# EAGLE design Final (EAGLE 9.4.2)
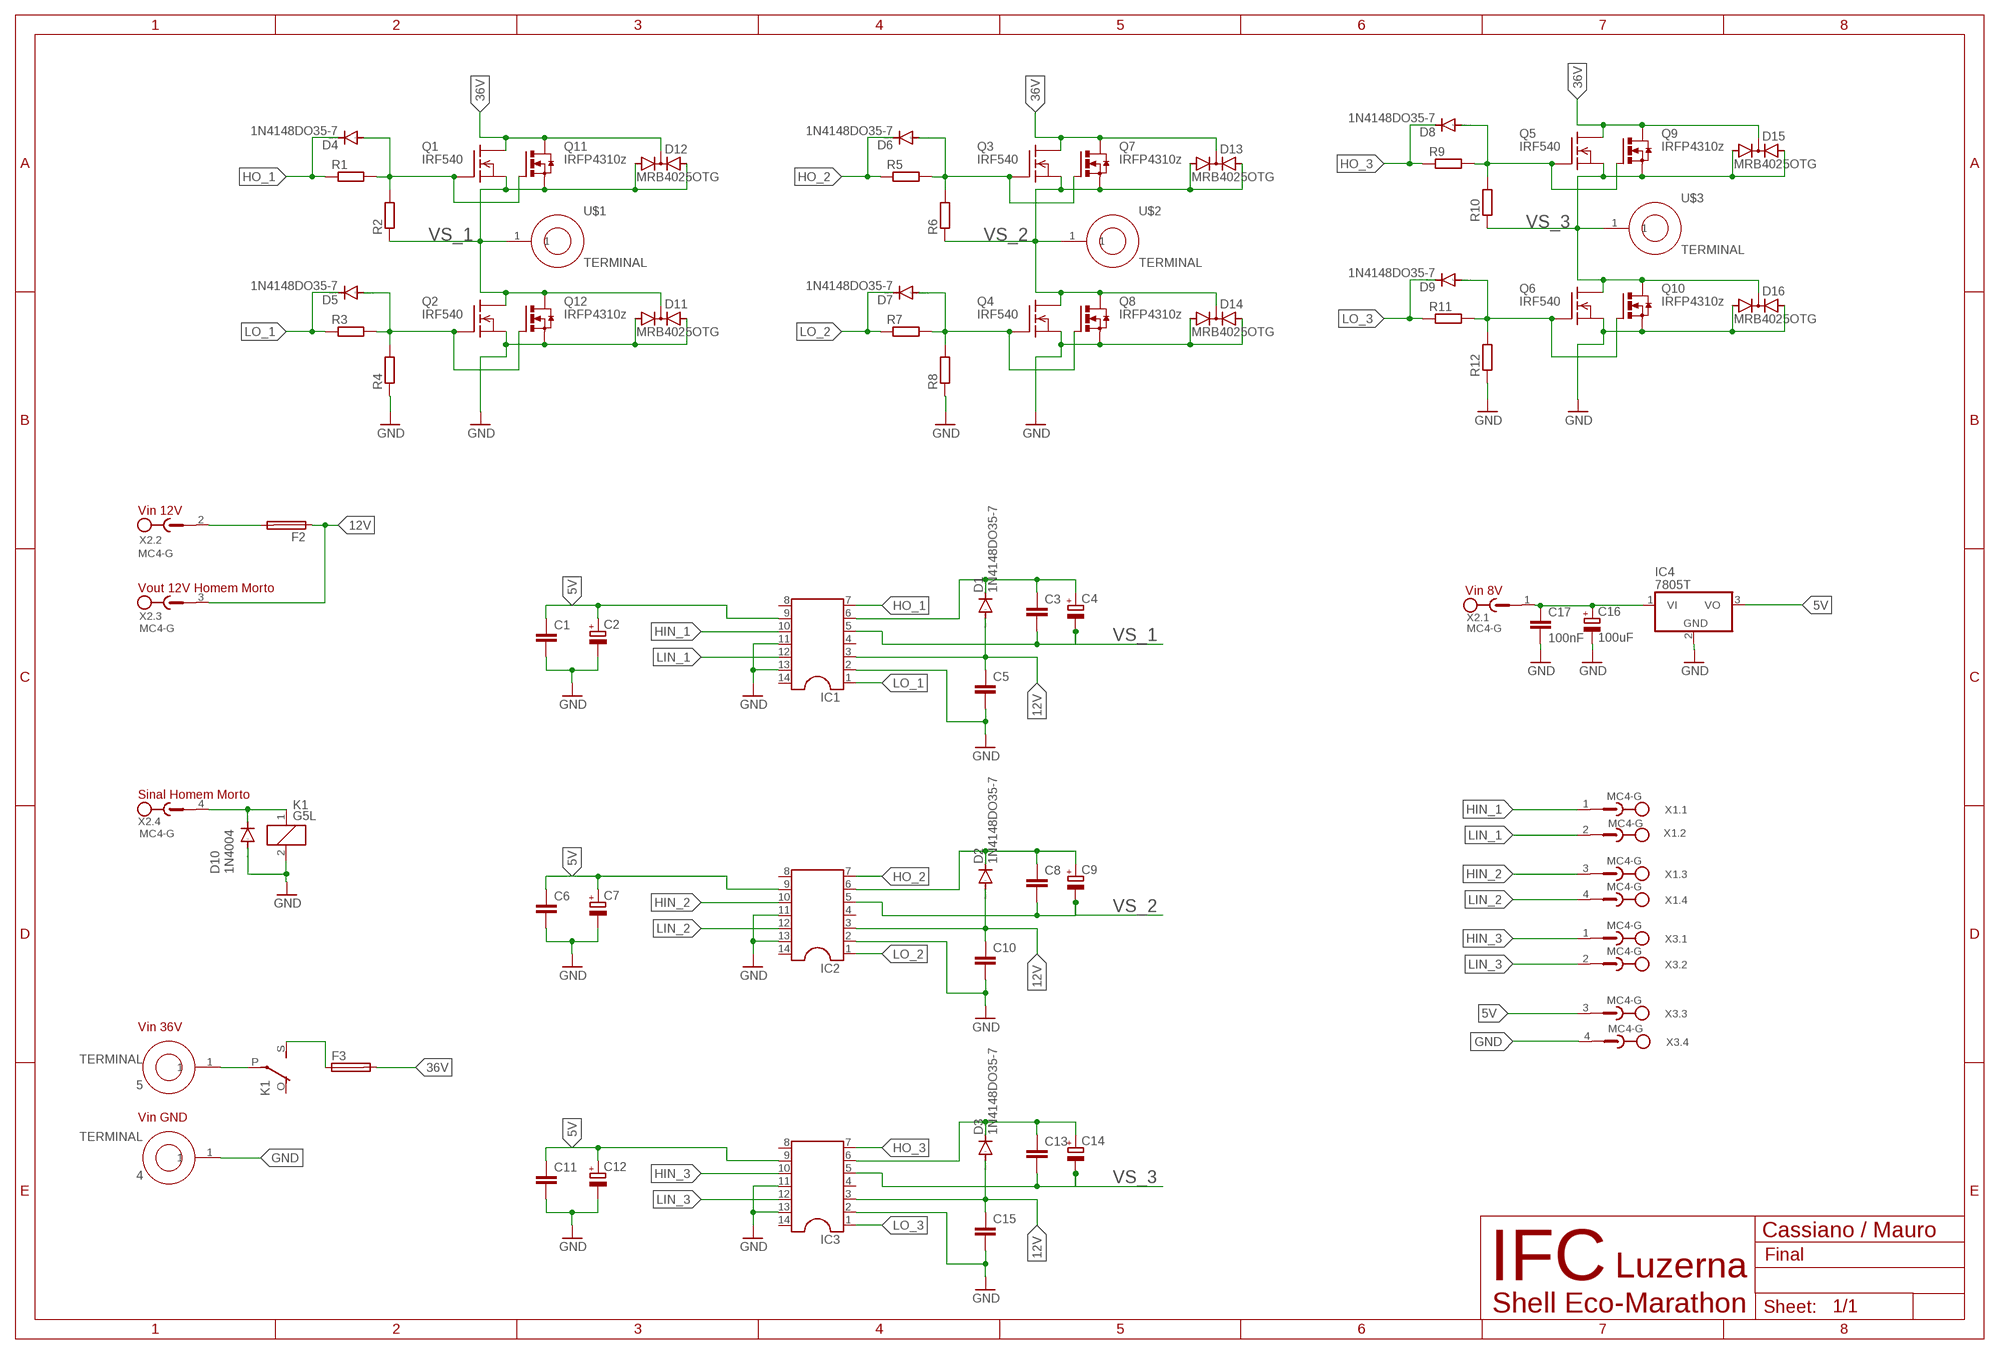
[diagram p0: schematic, sheet 1]

## Parts
4  TERMINAL  [TERMINAL]
5  TERMINAL  [TERMINAL]
C1  C-EU050-045X075  [C050-045X075]
C2  CPOL-EUE2.5-7  [E2,5-7]
C3  C-EU050-025X075  [C050-025X075]
C4  CPOL-EUE2.5-7  [E2,5-7]
C5  C-EU050-025X075  [C050-025X075]
C6  C-EU050-045X075  [C050-045X075]
C7  CPOL-EUE2.5-7  [E2,5-7]
C8  C-EU050-025X075  [C050-025X075]
C9  CPOL-EUE2.5-7  [E2,5-7]
C10  C-EU050-025X075  [C050-025X075]
C11  C-EU050-045X075  [C050-045X075]
C12  CPOL-EUE2.5-7  [E2,5-7]
C13  C-EU050-025X075  [C050-025X075]
C14  CPOL-EUE2.5-7  [E2,5-7]
C15  C-EU050-025X075  [C050-025X075]
C16  100uF  CPOL-EUE2.5-7  [E2,5-7]
C17  100nF  C-EU050-045X075  [C050-045X075]
D1  1N4148DO35-7  [DO35-7]
D2  1N4148DO35-7  [DO35-7]
D3  1N4148DO35-7  [DO35-7]
D4  1N4148DO35-7  [DO35-7]
D5  1N4148DO35-7  [DO35-7]
D6  1N4148DO35-7  [DO35-7]
D7  1N4148DO35-7  [DO35-7]
D8  1N4148DO35-7  [DO35-7]
D9  1N4148DO35-7  [DO35-7]
D10  1N4004  [DO41-10]
D11  MRB4025OTG  MUR620CT  [TO220AB]
D12  MRB4025OTG  MUR620CT  [TO220AB]
D13  MRB4025OTG  MUR620CT  [TO220AB]
D14  MRB4025OTG  MUR620CT  [TO220AB]
D15  MRB4025OTG  MUR620CT  [TO220AB]
D16  MRB4025OTG  MUR620CT  [TO220AB]
F2  SH22,5A  [SH22,5A]
F3  SH22,5A  [SH22,5A]
IC1  DIL14  [DIL14]
IC2  DIL14  [DIL14]
IC3  DIL14  [DIL14]
IC4  7805T  [TO220H]
K1  G5L  [G5LE]
Q1  IRF540  [TO220]
Q2  IRF540  [TO220]
Q3  IRF540  [TO220]
Q4  IRF540  [TO220]
Q5  IRF540  [TO220]
Q6  IRF540  [TO220]
Q7  IRFP4310z  IRFP240-H  [TO247BH]
Q8  IRFP4310z  IRFP240-H  [TO247BH]
Q9  IRFP4310z  IRFP240-H  [TO247BH]
Q10  IRFP4310z  IRFP240-H  [TO247BH]
Q11  IRFP4310z  IRFP240-H  [TO247BH]
Q12  IRFP4310z  IRFP240-H  [TO247BH]
R1  R-EU_0204/7  [0204/7]
R2  R-EU_0204/7  [0204/7]
R3  R-EU_0204/7  [0204/7]
R4  R-EU_0204/7  [0204/7]
R5  R-EU_0204/7  [0204/7]
R6  R-EU_0204/7  [0204/7]
R7  R-EU_0204/7  [0204/7]
R8  R-EU_0204/7  [0204/7]
R9  R-EU_0204/7  [0204/7]
R10  R-EU_0204/7  [0204/7]
R11  R-EU_0204/7  [0204/7]
R12  R-EU_0204/7  [0204/7]
U$1  TERMINAL  [TERMINAL]
U$2  TERMINAL  [TERMINAL]
U$3  TERMINAL  [TERMINAL]
X1  MC4-G  [MC4-G]
X2  MC4-G  [MC4-G]
X3  MC4-G  [MC4-G]

## Nets
5V: C1.1 C2.+ C6.1 C7.+ C11.1 C12.+ IC1.9 IC2.9 IC3.9 IC4.3(VO) X3.3
12V: C5.1 C10.1 C15.1 D1.A D2.A D3.A F2.1 IC1.3 IC2.3 IC3.3 X2.3
36V: D12.C D13.C D15.C F3.2 Q1.2(D) Q3.2(D) Q5.2(D) Q7.D Q9.D Q11.D
GND: 4.1 C1.2 C2.- C5.2 C6.2 C7.- C10.2 C11.2 C12.- C15.2 C16.- C17.2 D10.A D11.A1 D11.A2 D14.A1 D14.A2 D16.A1 D16.A2 IC1.2 IC1.11 IC1.13 IC2.2 IC2.11 IC2.13 IC3.2 IC3.11 IC3.13 IC4.2(GND) K1.2 Q2.3(S) Q4.3(S) Q6.3(S) Q8.S Q10.S Q12.S R4.1 R8.1 R12.1 X3.4
HIN_1: IC1.10 X1.1
HIN_2: IC2.10 X1.3
HIN_3: IC3.10 X3.1
HO_1: D4.C IC1.7 R1.1
HO_2: D6.C IC2.7 R5.1
HO_3: D8.C IC3.7 R9.1
LIN_1: IC1.12 X1.2
LIN_2: IC2.12 X1.4
LIN_3: IC3.12 X3.2
LO_1: D5.C IC1.1 R3.1
LO_2: D7.C IC2.1 R7.1
LO_3: D9.C IC3.1 R11.1
N$1: D4.A Q1.1(G) Q11.G R1.2 R2.2
N$2: D5.A Q2.1(G) Q12.G R3.2 R4.2
N$3: F3.1 K1.S(2:S)
N$4: D6.A Q3.1(G) Q7.G R5.2 R6.2
N$5: D7.A Q4.1(G) Q8.G R7.2 R8.2
N$6: F2.2 X2.2
N$7: D8.A Q5.1(G) Q9.G R9.2 R10.2
N$8: D9.A Q6.1(G) Q10.G R11.2 R12.2
N$9: C16.+ C17.1 IC4.1(VI) X2.1
N$10: D10.C K1.1 X2.4
N$11: 5.1 K1.P(2:P)
VB_1: C3.1 C4.+ D1.C IC1.6
VB_2: C8.1 C9.+ D2.C IC2.6
VB_3: C13.1 C14.+ D3.C IC3.6
VS_1: C3.2 C4.- D11.C D12.A1 D12.A2 IC1.5 Q1.3(S) Q2.2(D) Q11.S Q12.D R2.1 U$1.1
VS_2: C8.2 C9.- D13.A1 D13.A2 D14.C IC2.5 Q3.3(S) Q4.2(D) Q7.S Q8.D R6.1 U$2.1
VS_3: C13.2 C14.- D15.A1 D15.A2 D16.C IC3.5 Q5.3(S) Q6.2(D) Q9.S Q10.D R10.1 U$3.1
Unconnected: IC1.4 IC1.8 IC1.14 IC2.4 IC2.8 IC2.14 IC3.4 IC3.8 IC3.14 K1.O(2:O)

## Notes on the sheet
- Vin 12V
- Vout 12V Homem Morto
- Vin 8V
- Sinal Homem Morto
- Vin 36V
- Vin GND
- Cassiano / Mauro
- IFC | Luzerna
- Shell Eco-Marathon

## Library data of the parts
4 5 U$1-U$3 = ,Kerschbaumer:TERMINAL
C1 C3 C5 C6 C8 C10 C11 C13 C15 C17 = rcl:C-EU: CAPACITOR, European symbol
C2 C4 C7 C9 C12 C14 C16 = rcl:CPOL-EU: POLARIZED CAPACITOR, European symbol
D1-D9 = diode:1N4148: DIODE high speed (Philips)
D10 = diode:1N4004: DIODE general purpose rectifier, 1 A
D11-D16 = diode:MUR620CT: DIODE dual rectifier, 6 A, 200 V, common cathode
F2 F3 = fuse:SH22,5A: FUSE HOLDER grid 22,5mm, isolated cap OGN0031 8201, Schurter (Buerklin); MPN: 0031.7701.11; OC_FARNELL: unknown; OC_NEWARK: 04F1224
IC1-IC3 = ic-package:DIL14: Dual In Line / Socket
IC4 = ,RK_outros:78*: Positive VOLTAGE REGULATOR
K1 = relay:G5L: RELAY 1 x switch, 10 A/120 V AC, 8 A/30 V ADC, Omron; OC_FARNELL: unknown; OC_NEWARK: unknown
Q1-Q6 = transistor-fet:IRF540: N-Channel Enhancement MOSFET (HEXFET); 100V; 28A; 0,077Ohm
Q7-Q12 = transistor-power:IRFP240: HEXFET Power MosFet Source: http://www.irf.com/
R1-R12 = rcl:R-EU_: RESISTOR, European symbol
X1-X3 = con-phoenix-381_l:MC4-G: Mini-Combicon 3.81mm horizontal 4-polig MC 1,5/4-G-3,81 Artikel-Nr. 1803293 mit Gegenstecker MC 1,5/4-ST-3,81 Artikel-Nr. 1803594

## Board
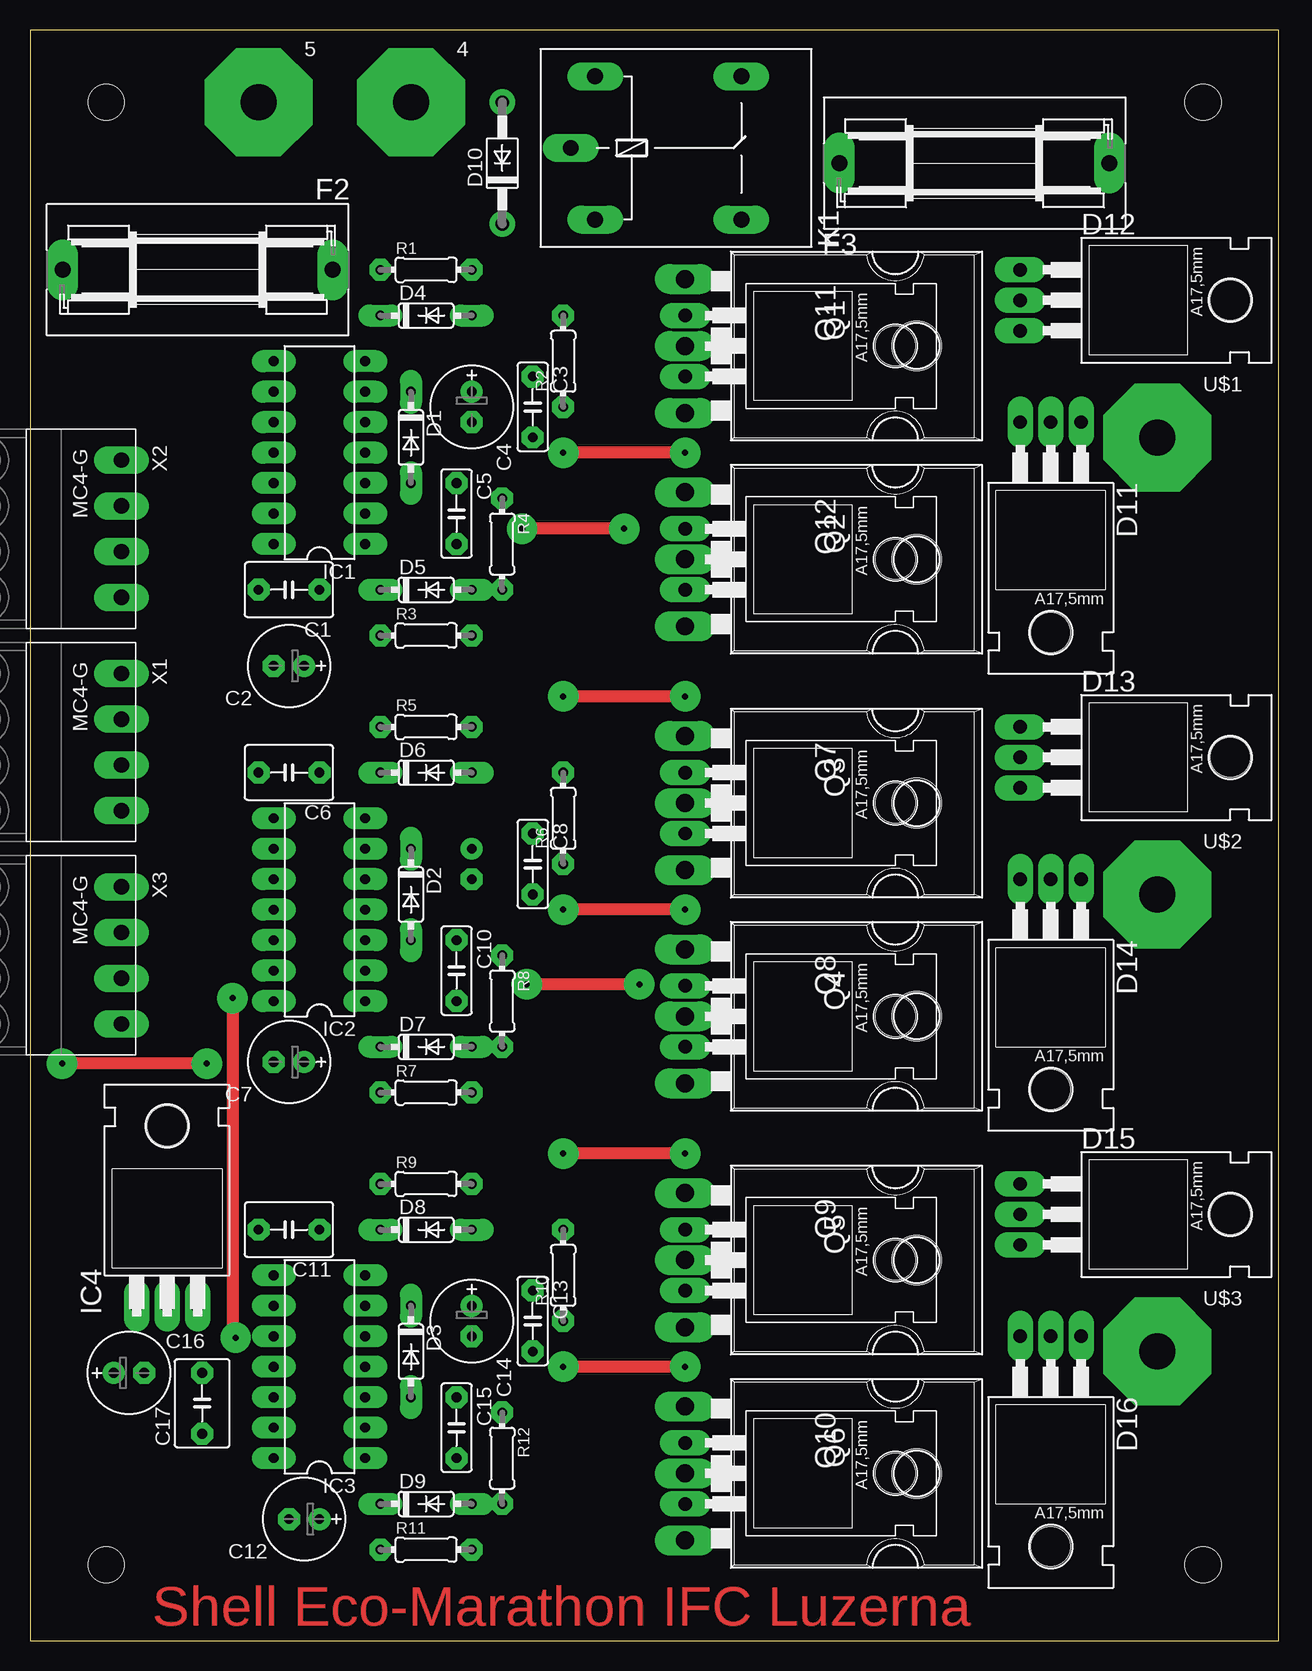
[diagram p1: board, top side]
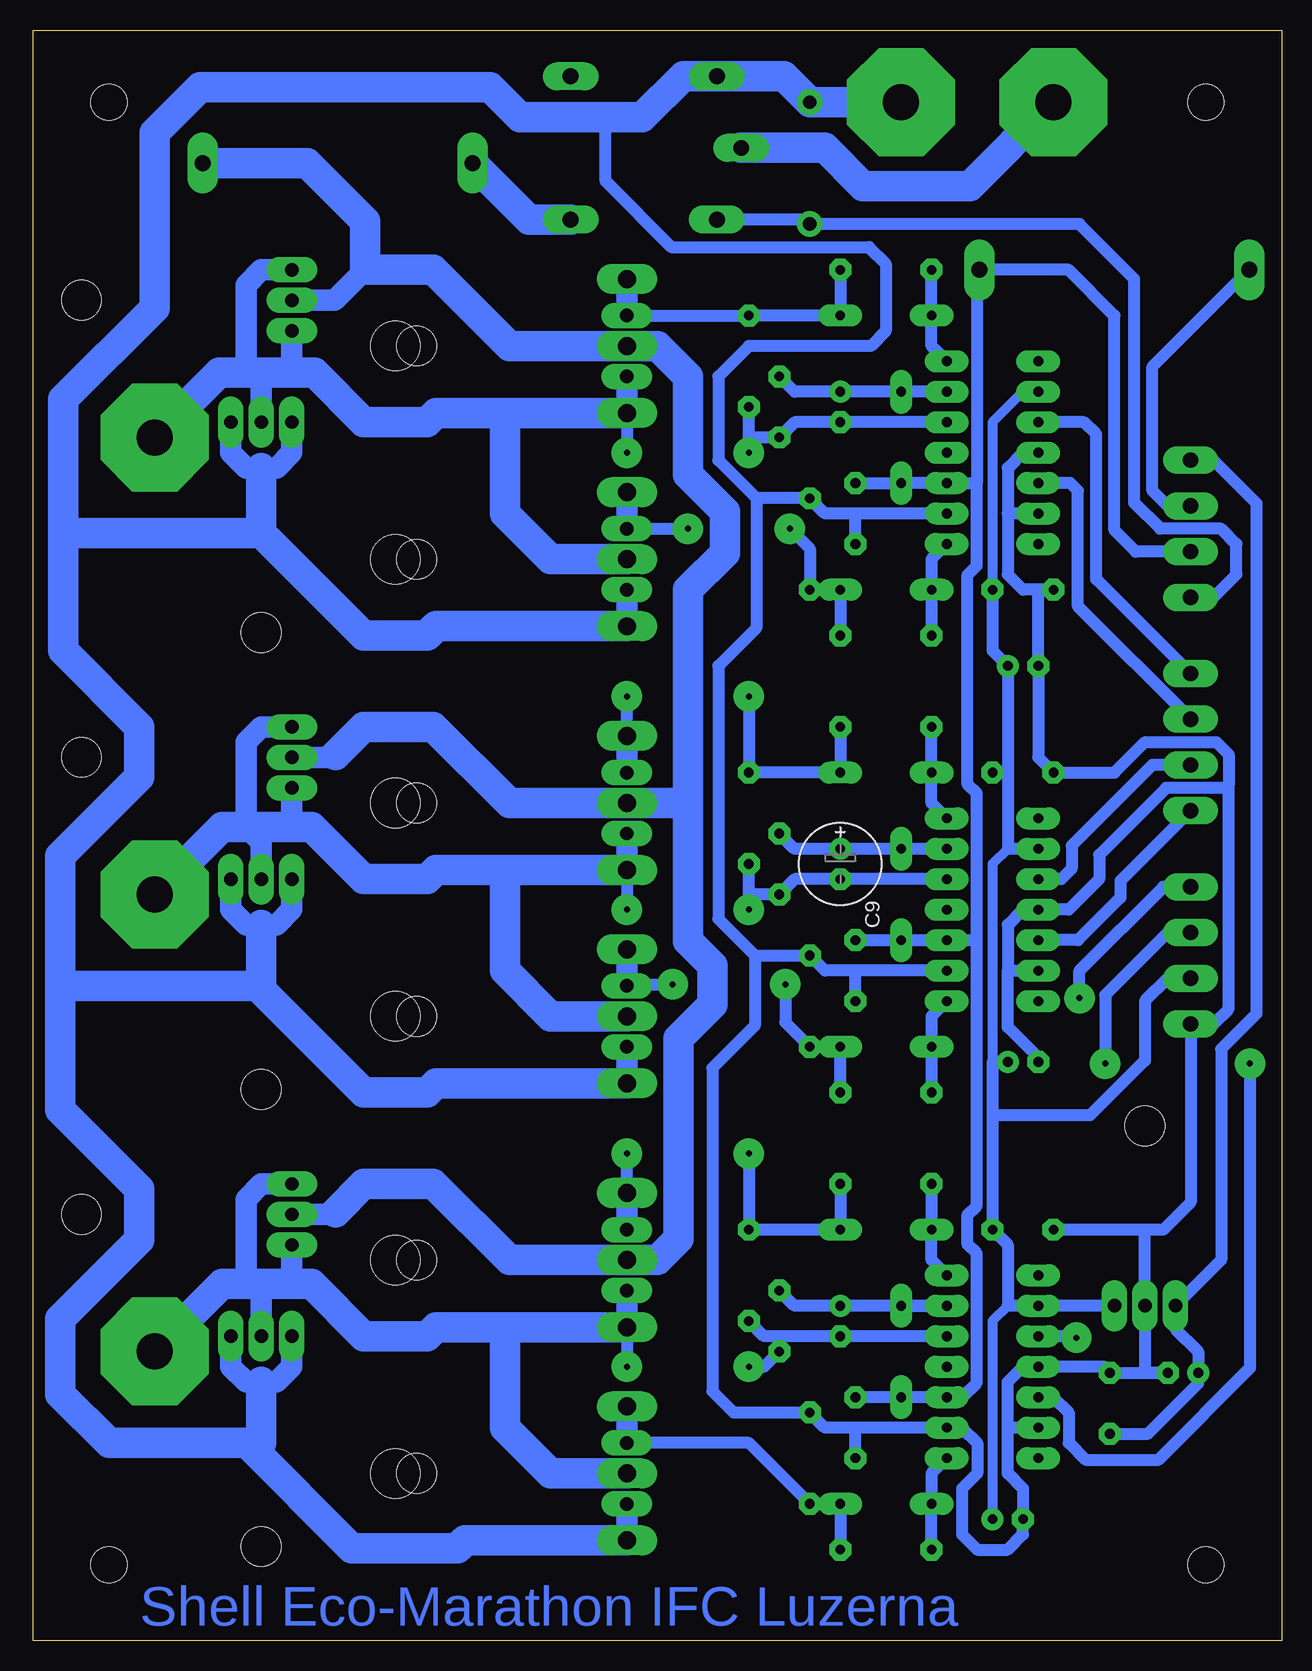
[diagram p2: board, bottom side, seen from below]

Size 104.12 x 134.29 mm. Coordinates in mm from the lower left corner, seen from the top.
Outline: 0,0 104.12,0 104.12,134.29 0,134.29 0,0
Copper layers (1*16): Top 0.035mm / dielectric 1.5mm / Bottom 0.035mm
Design rules "default *": minimum track width 6mil, minimum drill 0.35mm, track to track 12mil, track to pad 12mil, pad to pad 12mil, via to via 12mil, smd to smd 12mil, copper to edge 40mil, drill to drill 6mil, minimum pad ring 20mil, minimum via ring 15mil, stop-mask expansion 4mil, vias tented up to drill 0mil, thermal gap 10mil
Holes 3 mm at 6.35,128.27 97.79,128.27 6.35,6.35 97.79,6.35

### Footprints (pad centres in the part's own frame; a part is rotated, then mirrored left to right if it is on the bottom)
TERMINAL = drill 3 pad 9 octagon: 1 0,0
C050-045X075 = drill 0.813 octagon: 1 -2.54,0; 2 2.54,0
E2,5-7 = drill 0.813 pad 1.6: + -1.27,0 | drill 0.813 pad 1.6 octagon: - 1.27,0
C050-025X075 = drill 0.813 octagon: 1 -2.54,0; 2 2.54,0
DO35-7 = drill 0.813 long: A 3.81,0; C -3.81,0
DO41-10 = drill 1.118: A 5.08,0; C -5.08,0
TO220AB = drill 1.118 long: A1 -2.54,-6.35; A2 2.54,-6.35; C 0,-6.35 | hole 3.302: 0,11.176
SH22,5A = drill 1.321 pad 2.54 long: 1 -11.252,0; 2 11.252,0
DIL14 = drill 0.813 long: 1 -7.62,-3.81; 2 -5.08,-3.81; 3 -2.54,-3.81; 4 0,-3.81; 5 2.54,-3.81; 6 5.08,-3.81; 7 7.62,-3.81; 8 7.62,3.81; 9 5.08,3.81; 10 2.54,3.81; 11 0,3.81; 12 -2.54,3.81; 13 -5.08,3.81; 14 -7.62,3.81
TO220H = drill 1.118 long: 1 -2.54,-10.16; 2 0,-10.16; 3 2.54,-10.16 | hole 3.302: 0,4.826
G5LE = drill 1.321 long: 1 -7.493,-5.969; 2 -7.493,5.969; O 4.699,5.969; P -9.525,0; S 4.699,-5.969
TO220 = drill 1.118 long: 1 -2.54,-6.35; 2 0,-6.35; 3 2.54,-6.35 | hole 3.302: 0,11.176
TO247BH = drill 1.499 long: D 0,-10.16; G -5.588,-10.16; S 5.588,-10.16 | hole 4.115: 0,9.144
0204/7 = drill 0.813 octagon: 1 -3.81,0; 2 3.81,0
MC4-G = drill 1.27 long: 1 -5.715,0; 2 -1.905,0; 3 1.905,0; 4 5.715,0

### Placement (x,y rotation side)
4  31.75,128.27 0 top
5  19.05,128.27 0 top
C1  21.59,87.63 180 top
C2  21.59,81.28 180 top
C3  41.91,102.87 270 top
C4  36.83,102.87 270 top
C5  35.56,93.98 270 top
C6  21.59,72.39 180 top
C7  21.59,48.26 180 top
C8  41.91,64.77 270 top
C9  36.83,64.77 270 bottom
C10  35.56,55.88 270 top
C11  21.59,34.29 180 top
C12  22.86,10.16 180 top
C13  41.91,26.67 270 top
C14  36.83,26.67 270 top
C15  35.56,17.78 270 top
C16  8.25,22.35 0 top
C17  14.35,19.81 90 top
D1  31.75,100.33 270 top
D2  31.75,62.23 270 top
D3  31.75,24.13 270 top
D4  33.02,110.49 0 top
D5  33.02,87.63 0 top
D6  33.02,72.39 0 top
D7  33.02,49.53 0 top
D8  33.02,34.29 0 top
D9  33.02,11.43 0 top
D10  39.37,123.19 90 top
D11  85.09,95.25 180 top
D12  88.9,111.76 270 top
D13  88.9,73.66 270 top
D14  85.09,57.15 180 top
D15  88.9,35.56 270 top
D16  85.09,19.05 180 top
F2  13.97,114.3 180 top
F3  78.74,123.19 0 top
IC1  24.13,99.06 90 top
IC2  24.13,60.96 90 top
IC3  24.13,22.86 90 top
IC4  11.43,38.1 0 top
K1  54.61,124.46 0 top
Q1  60.96,107.95 270 top
Q2  60.96,90.17 270 top
Q3  60.96,69.85 270 top
Q4  60.96,52.07 270 top
Q5  60.96,31.75 270 top
Q6  60.96,13.97 270 top
Q7  64.77,69.85 270 top
Q8  64.77,52.07 270 top
Q9  64.77,31.75 270 top
Q10  64.77,13.97 270 top
Q11  64.77,107.95 270 top
Q12  64.77,90.17 270 top
R1  33.02,114.3 0 top
R2  44.45,106.68 90 top
R3  33.02,83.82 0 top
R4  39.37,91.44 270 top
R5  33.02,76.2 0 top
R6  44.45,68.58 90 top
R7  33.02,45.72 0 top
R8  39.37,53.34 270 top
R9  33.02,38.1 0 top
R10  44.45,30.48 90 top
R11  33.02,7.62 0 top
R12  39.37,15.24 270 top
U$1  93.98,100.33 0 top
U$2  93.98,62.23 0 top
U$3  93.98,24.13 0 top
X1  7.62,74.93 270 top
X2  7.62,92.71 270 top
X3  7.62,57.15 270 top

### Tracks (layer width: path | path; a pad name or v marks a point on that pad's centre or on a via)
5V
  Bottom 0.813: 21.59,104.14 24.13,101.6 C1.1 | 24.13,48.26 24.13,64.77 22.86,66.04 | 22.86,27.94 24.13,26.67 C12.+
  Bottom 1.016: IC1.9 21.59,104.14 | C1.1 24.13,82.55 C2.+ 22.86,72.39 | 22.86,72.39 22.86,66.04 IC2.9 | 24.13,43.81 24.13,48.26 C7.+ | 24.13,43.81 C11.1 22.86,33.02 22.86,27.94 IC3.9 IC4.3 | C6.1 22.86,72.39 | X3.3 9.52,55.25 11.43,53.34 11.43,48.39 16,43.81 24.13,43.81
12V
  Bottom 1.016: C15.1 D3.A IC3.3 26.67,20.32 25.45,21.54 25.45,32.29 26.21,33.06 26.21,35.53 25.45,36.29 25.45,58.42 | 25.45,96.52 25.45,114.07 F2.1 17.78,114.3 13.97,110.49 13.97,92.58 12.19,90.81 X2.3 | 25.45,96.52 IC1.3 D1.A C5.1 | C10.1 D2.A IC2.3 25.45,58.42 | 25.45,58.42 25.45,70.65 26.21,71.41 26.21,88.87 25.45,89.63 25.45,96.52
36V
  Bottom 1.778: 76.45,114.3 78.99,111.76 D12.C | 78.91,73.83 79.08,73.66 D13.C | 78.74,35.56 D15.C 79.08,35.56 78.91,35.73
  Bottom 2.54: F3.2 81.28,123.19 76.45,118.36 76.45,114.3 70.76,114.3 64.41,107.95 Q11.D 52.07,107.95 49.53,105.41 49.53,97.22 46.46,94.15 46.46,90.71 49.53,87.63 49.53,69.85 | 49.53,69.85 49.53,58.36 47.47,56.3 47.47,53.05 50.29,50.23 50.29,33.53 52.07,31.75 Q9.D 64.41,31.75 70.76,38.1 76.54,38.1 78.91,35.73 | 49.53,69.85 Q7.D 64.41,69.85 70.76,76.2 76.54,76.2 78.91,73.83
GND
  Bottom 1.016: 35.56,17.78 IC3.2 26.67,17.78 25.4,16.51 25.4,13.97 26.67,12.7 26.67,8.89 25.4,7.62 22.86,7.62 21.59,8.89 C12.- 21.59,12.7 22.86,13.97 22.86,17.78 | 35.56,17.78 38.1,17.78 R12.1 45.72,19.05 47.5,20.83 47.5,47.75 43.94,51.31 43.94,57.15 | C15.2 35.56,17.78 | IC2.2 35.56,55.88 | 35.56,55.88 38.1,55.88 R8.1 43.94,57.15 | C10.2 35.56,55.88 | IC1.2 35.56,93.98 | 35.56,93.98 38.1,93.98 R4.1 43.81,95.25 | C5.2 35.56,93.98 | 43.81,95.25 46.99,98.43 46.99,105.41 44.45,107.95 34.29,107.95 33.02,109.22 33.02,114.81 34.42,116.2 50.93,116.2 56.39,121.67 56.39,127 | 43.81,95.25 43.81,84.45 46.99,81.28 46.99,60.2 43.94,57.15 | 11.43,34.29 IC4.2 11.43,22.35 C16.- C17.2 14.86,22.86 IC3.11 21.59,22.86 22.86,21.59 22.86,17.78 | 11.43,34.29 C11.2 | IC1.11 21.59,99.06 22.86,97.79 22.86,93.98 | IC1.13 22.86,93.98 | 22.86,93.98 22.86,88.9 21.59,87.63 20.32,87.63 | C1.2 20.32,87.63 | 20.32,87.63 C2.- 20.32,73.66 C6.2 13.97,72.39 11.43,74.93 5.46,74.93 4.45,73.91 4.45,71.31 | 4.45,71.31 4.64,71.12 9.65,71.12 15.24,65.53 15.24,63.5 17.78,60.96 IC2.11 21.59,60.96 22.86,59.69 22.86,55.88 | 22.86,55.88 IC2.13 | C7.- 20.32,48.64 22.86,51.18 22.86,55.88 | IC3.13 22.86,17.78 | 4.45,71.31 4.45,52.7 5.71,51.44 X3.4 7.62,36.58 9.91,34.29 11.43,34.29 | 85.09,16.51 86.32,16.51
  Bottom 1.778: Q2.3 Q12.S | Q4.3 Q8.S | Q6.3 Q10.S | D11.A2 82.55,99.06 83.82,97.79 85.09,97.79 86.36,97.79 87.63,99.06 D11.A1 | D14.A2 82.55,60.96 83.82,59.69 85.09,59.69 86.36,59.69 87.63,60.96 D14.A1 87.63,62.23 | D16.A2 82.55,22.86 83.82,21.59 85.09,21.59 86.36,21.59 87.63,22.86 D16.A1
  Bottom 2.54: 4.1 D10.A 41.53,130.43 K1.2 49.91,130.43 53.34,127 56.39,127 63.5,127 66.04,129.54 90.17,129.54 93.98,125.73 93.98,111.12 101.6,103.5 101.6,92.71 | Q10.S 68.11,8.38 68.74,7.75 77.56,7.75 86.32,16.51 97.79,16.51 101.83,20.55 101.83,26.86 95.25,33.44 95.25,37.68 101.83,44.26 101.83,54.61 | 85.09,21.59 85.09,16.51 | Q8.S 70.52,46.48 71.28,45.72 76.54,45.72 85.09,54.27 | 85.09,59.69 85.09,54.27 | Q12.S 70.52,84.58 71.28,83.82 76.54,83.82 85.09,92.37 | 85.09,97.79 85.09,92.37 | 101.6,92.71 101.6,82.55 95.25,76.2 95.25,72 101.83,65.42 101.83,54.61 | 85.09,54.27 85.43,54.61 101.83,54.61 | 85.09,92.37 101.26,92.37 101.6,92.71
HIN_1
  Bottom 1.016: X1.1 15.49,88.52 15.49,100.58 16.51,101.6 IC1.10
HIN_2
  Bottom 1.016: X1.3 10.8,73.03 17.53,66.29 17.53,64.39 18.41,63.5 IC2.10
HIN_3  (via drill 0.5 pad 2.54)
  Top 1.016: v16.89,53.59 16.89,25.53 v17.14,25.27
  Bottom 1.016: X3.1 9.91,62.86 16.89,55.88 v16.89,53.59 | v17.14,25.27 17.27,25.4 IC3.10
HO_1
  Bottom 1.016: IC1.7 29.21,107.95 D4.C R1.1
HO_2
  Bottom 1.016: IC2.7 29.21,69.85 D6.C R5.1
HO_3
  Bottom 1.016: IC3.7 29.21,31.75 D8.C R9.1
LIN_1
  Bottom 1.016: X1.2 17.02,86.23 17.02,95.89 17.65,96.52 IC1.12
LIN_2
  Bottom 1.016: X1.4 13.46,63.37 13.46,61.98 17.02,58.42 IC2.12
LIN_3  (via drill 0.5 pad 2.54)
  Top 1.016: v14.73,48.13 v2.67,48.13
  Bottom 1.016: X3.2 9.52,59.06 14.73,53.85 v14.73,48.13 | v2.67,48.13 2.67,22.73 10.29,15.11 16.38,15.11 17.78,16.51 17.78,19.05 19.05,20.32 IC3.12
LO_1
  Bottom 1.016: IC1.1 29.21,90.17 D5.C R3.1
LO_2
  Bottom 1.016: IC2.1 29.21,52.07 D7.C R7.1
LO_3
  Bottom 1.016: IC3.1 29.21,13.97 D9.C R11.1
N$1
  Bottom 1.016: Q1.1 R2.2 D4.A R1.2
  Bottom 1.778: Q11.G Q1.1
N$2  (via drill 0.5 pad 2.54)
  Top 1.016: v49.53,92.71 v41.02,92.71
  Bottom 1.016: Q2.1 v49.53,92.71 | v41.02,92.71 39.37,91.06 R4.2 D5.A R3.2
  Bottom 1.778: Q12.G Q2.1
N$3
  Bottom 2.54: K1.S 62.79,118.49 F3.1
N$4  (via drill 0.5 pad 2.54)
  Top 1.016: v54.61,78.74 v44.45,78.74
  Bottom 1.016: Q3.1 v54.61,78.74 | v44.45,78.74 R6.2 D6.A R5.2
  Bottom 1.778: Q7.G Q3.1
N$5  (via drill 0.5 pad 2.54)
  Top 1.016: v50.8,54.74 v41.4,54.74
  Bottom 1.016: Q4.1 54.48,54.74 v50.8,54.74 | v41.4,54.74 41.4,51.56 R8.2 D7.A R7.2
  Bottom 1.778: Q4.1 Q8.G
N$6
  Bottom 1.016: X2.2 9.52,94.62 10.8,95.89 10.8,106.22 F2.2
N$7  (via drill 0.5 pad 2.54)
  Top 1.016: v54.61,40.64 v44.45,40.64
  Bottom 1.016: Q5.1 v54.61,40.64 | v44.45,40.64 R10.2 D8.A R9.2
  Bottom 1.778: Q5.1 Q9.G
N$8
  Bottom 1.016: Q6.1 44.45,16.51 R12.2 D9.A R11.2
  Bottom 1.778: Q10.G Q6.1
N$9
  Bottom 1.016: X2.1 5.71,98.43 2.13,94.84 2.13,52.28 5.08,49.34 5.08,31.75 IC4.1 8.89,26.04 6.98,24.13 C16.+ 6.98,21.46 11.18,17.27 C17.1
N$10
  Bottom 1.016: K1.1 39.75,118.49 D10.C 16.89,118.11 12.32,113.54 12.32,94.87 10.16,92.71 5.08,92.71 3.81,91.44 3.81,88.9 5.71,87 X2.4
N$11
  Bottom 2.54: 5.1 26.04,121.29 34.92,121.29 38.1,124.46 K1.P
VB_1
  Bottom 1.016: IC1.6 D1.C C4.+ 40.64,104.14 C3.1
VB_2
  Bottom 1.016: IC2.6 D2.C C9.+ 40.64,66.04 C8.1
VB_3
  Bottom 1.016: C13.1 40.64,27.94 C14.+ IC3.6 D3.C
VS_1  (via drill 0.5 pad 2.54)
  Top 1.016: v54.61,99.06 v44.45,99.06
  Bottom 1.016: Q11.S v54.61,99.06 | v44.45,99.06 44.45,100.33 | 44.45,100.33 R2.1 | 44.45,100.33 C3.2 40.64,101.6 C4.- IC1.5
  Bottom 1.778: 86.36,105.72 86.36,113.03 85.09,114.3 D12.A1 | Q11.S Q1.3 | D12.A2 82.55,105.72 | D11.C 85.09,105.72
  Bottom 2.54: 64.77,102.36 70.52,102.36 71.28,101.6 76.54,101.6 80.66,105.72 82.55,105.72 85.09,105.72 86.36,105.72 88.59,105.72 U$1.1 | 64.77,102.36 Q11.S | Q12.D 60.96,90.17 64.77,93.98 64.77,102.36
VS_2  (via drill 0.5 pad 2.54)
  Top 1.016: v54.61,60.96 v44.45,60.96
  Bottom 1.016: Q7.S v54.61,60.96 | v44.45,60.96 44.45,62.23 | 44.45,62.23 R6.1 | 44.45,62.23 C8.2 40.64,63.5 C9.- IC2.5
  Bottom 1.778: Q3.3 Q7.S | D13.A2 82.55,67.87 | D13.A1 85.09,76.2 86.36,74.93 86.36,67.87 85.09,66.6 D14.C
  Bottom 2.54: 64.77,64.26 70.52,64.26 71.28,63.5 76.54,63.5 80.91,67.87 82.55,67.87 86.36,67.87 88.34,67.87 U$2.1 | 64.77,64.26 Q7.S | Q8.D 60.96,52.07 64.77,55.88 64.77,64.26
VS_3  (via drill 0.5 pad 2.54)
  Top 1.016: v54.61,22.86 v44.45,22.86
  Bottom 1.016: IC3.5 C14.- 41.91,25.4 | 41.91,25.4 43.18,25.4 R10.1 | 41.91,25.4 C13.2 43.18,22.86 v44.45,22.86 | Q9.S v54.61,22.86
  Bottom 1.778: 86.36,29.77 86.36,36.83 85.09,38.1 D15.A1 | Q5.3 Q9.S | D16.C 85.09,29.77 | D15.A2 82.55,29.77
  Bottom 2.54: 64.77,26.16 70.52,26.16 71.28,25.4 76.54,25.4 80.91,29.77 82.55,29.77 85.09,29.77 86.36,29.77 88.34,29.77 U$3.1 | 64.77,26.16 Q9.S | Q10.D 60.96,13.97 64.77,17.78 64.77,26.16

### Text on the board
Top: Shell Eco-Marathon IFC Luzerna
Bottom: Shell Eco-Marathon IFC Luzerna